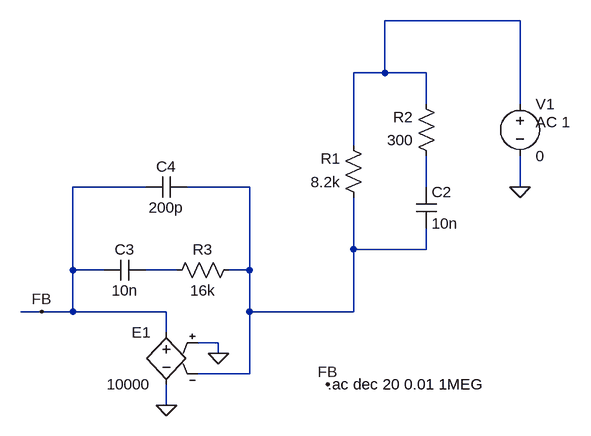
[diagram p0: schematic ErrorAmp.asc]
ErrorAmp.asc, the LTspice schematic file:
Version 4
SHEET 1 880 680
WIRE 624 -192 416 -192
WIRE 416 -112 416 -192
WIRE 416 -112 368 -112
WIRE 480 -112 416 -112
WIRE 480 -64 480 -112
WIRE 624 -64 624 -192
WIRE 368 0 368 -112
WIRE 48 64 -64 64
WIRE 208 64 112 64
WIRE 480 64 480 16
WIRE 624 64 624 16
WIRE 368 160 368 80
WIRE 480 160 480 128
WIRE 480 160 368 160
WIRE -64 192 -64 64
WIRE -16 192 -64 192
WIRE 96 192 48 192
WIRE 208 192 208 64
WIRE 208 192 176 192
WIRE -112 256 -144 256
WIRE -64 256 -64 192
WIRE -64 256 -112 256
WIRE 80 256 -64 256
WIRE 208 256 208 192
WIRE 368 256 368 160
WIRE 368 256 208 256
WIRE 80 288 80 256
WIRE 160 304 128 304
WIRE 160 320 160 304
WIRE 208 352 208 256
WIRE 208 352 128 352
WIRE 80 400 80 368
FLAG 80 400 0
FLAG 160 320 0
FLAG 624 64 0
FLAG -112 256 FB
FLAG 328 368 FB
SYMBOL voltage 624 -80 R0
WINDOW 123 24 44 Left 2
WINDOW 39 0 0 Left 2
SYMATTR InstName V1
SYMATTR Value 0
SYMATTR Value2 AC 1
SYMBOL e 80 272 M0
SYMATTR InstName E1
SYMATTR Value 10000
SYMBOL res 384 96 R180
WINDOW 0 36 76 Left 2
WINDOW 3 36 40 Left 2
SYMATTR InstName R1
SYMATTR Value 8.2k
SYMBOL cap 464 64 R0
SYMATTR InstName C2
SYMATTR Value 10n
SYMBOL res 80 208 R270
WINDOW 0 32 56 VTop 2
WINDOW 3 0 56 VBottom 2
SYMATTR InstName R3
SYMATTR Value 16k
SYMBOL cap 48 176 R90
WINDOW 0 0 32 VBottom 2
WINDOW 3 32 32 VTop 2
SYMATTR InstName C3
SYMATTR Value 10n
SYMBOL cap 112 48 R90
WINDOW 0 0 32 VBottom 2
WINDOW 3 32 32 VTop 2
SYMATTR InstName C4
SYMATTR Value 200p
SYMBOL res 496 32 R180
WINDOW 0 36 76 Left 2
WINDOW 3 36 40 Left 2
SYMATTR InstName R2
SYMATTR Value 300
TEXT 328 368 Left 2 !.ac dec 20 0.01 1MEG

The netlist it stands for:
* ErrorAmp.asc
V1 N001 0 0 AC 1
E1 FB 0 0 N002 10000
R1 N002 N001 8.2k
C2 N003 N002 10n
R3 N004 N002 16k
C3 N004 FB 10n
C4 N002 FB 200p
R2 N003 N001 300
.ac dec 20 0.01 1MEG
.backanno
.end

* Results of the author's LTspice run, read from the files saved beside the schematic
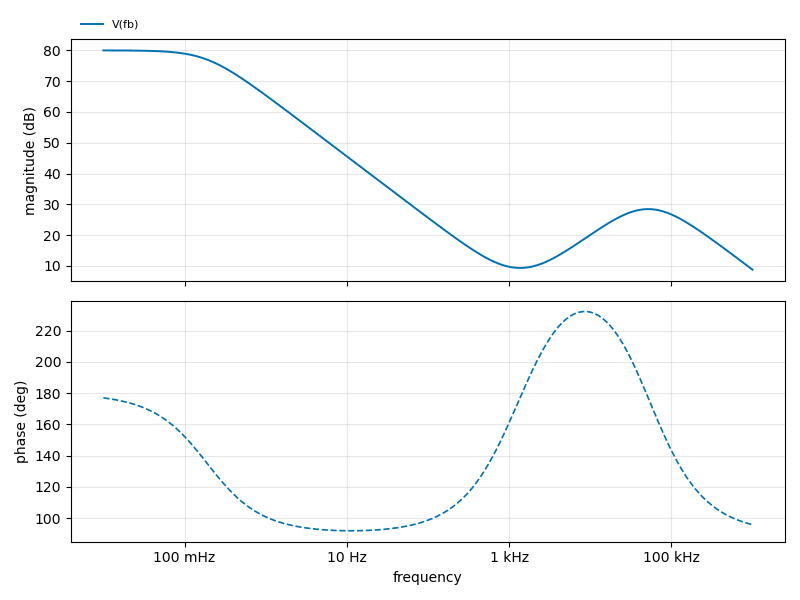
[diagram p1: AC Analysis of ErrorAmp.asc, plotted from the saved traces]
* AC Analysis, 1 run:
*   V(fb): 79.99 dB at 10 mHz, 8.76 dB at 1 MHz, peak 79.99 dB at 10 mHz, 3 dB below the peak at 190.4 mHz